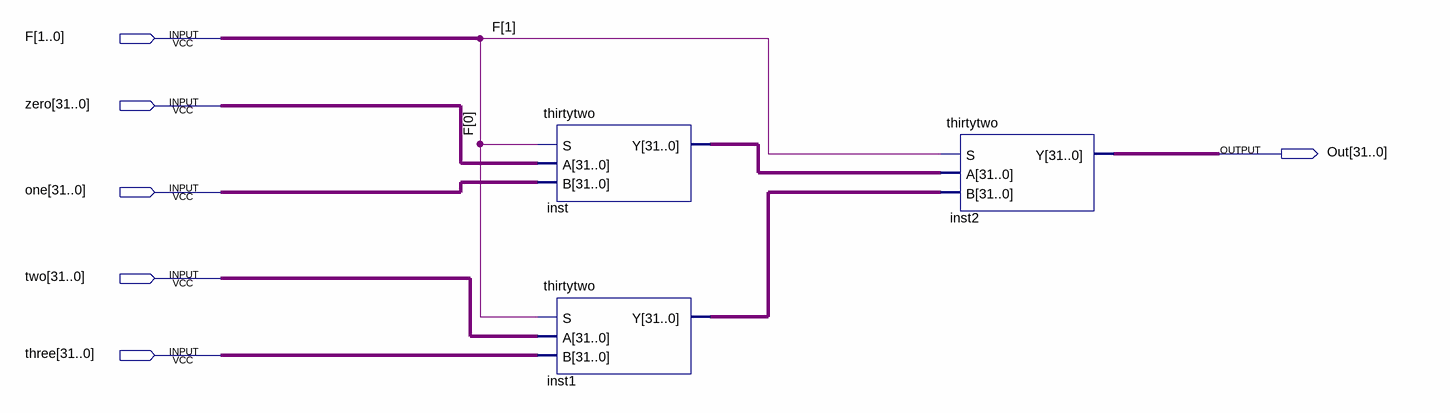
[diagram p0: schematic sheet]
// Quartus schematic fourchoices.bdf as structural Verilog: 3 symbols, 6 pins
module fourchoices (
  input  [1:0] F,
  input  [31:0] zero,
  input  [31:0] one,
  input  [31:0] two,
  input  [31:0] three,
  output [31:0] Out
);

  wire [31:0] inst1_y, inst_y;

  thirtytwo inst (.S(F[0]), .A(zero), .B(one), .Y(inst_y));
  thirtytwo inst1 (.S(F[0]), .A(two), .B(three), .Y(inst1_y));
  thirtytwo inst2 (.S(F[1]), .A(inst_y), .B(inst1_y), .Y(Out));
endmodule
